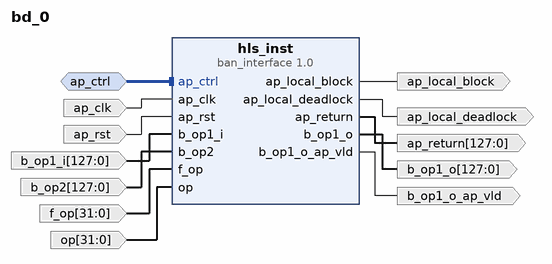
[diagram p0: block diagram of the top level]
# Vivado block design bd_0, xczu7ev-ffvc1156-2-e, Vivado 2021.2
create_bd_design bd_0

create_bd_intf_port -mode Slave -vlnv xilinx.com:interface:acc_handshake_rtl:1.0 ap_ctrl
create_bd_port -dir I -type clk ap_clk
set_property -dict {CONFIG.FREQ_HZ 100000000.0} [get_bd_ports ap_clk]
create_bd_port -dir O ap_local_block
create_bd_port -dir O ap_local_deadlock
create_bd_port -dir O -from 127 -to 0 -type data ap_return
create_bd_port -dir I -type rst ap_rst
set_property -dict {CONFIG.POLARITY ACTIVE_HIGH} [get_bd_ports ap_rst]
create_bd_port -dir I -from 127 -to 0 -type data b_op1_i
create_bd_port -dir O -from 127 -to 0 -type data b_op1_o
create_bd_port -dir O b_op1_o_ap_vld
create_bd_port -dir I -from 127 -to 0 -type data b_op2
create_bd_port -dir I -from 31 -to 0 -type data f_op
create_bd_port -dir I -from 31 -to 0 -type data op

create_bd_cell -type ip -vlnv xilinx.com:hls:ban_interface:1.0 hls_inst

# ---- connections ----

connect_bd_intf_net -intf_net ap_ctrl_0_1 [get_bd_intf_ports ap_ctrl] [get_bd_intf_pins hls_inst/ap_ctrl]
connect_bd_net -net ap_clk_0_1 [get_bd_ports ap_clk] [get_bd_pins hls_inst/ap_clk]
connect_bd_net -net ap_rst_0_1 [get_bd_ports ap_rst] [get_bd_pins hls_inst/ap_rst]
connect_bd_net -net b_op1_i_0_1 [get_bd_ports b_op1_i] [get_bd_pins hls_inst/b_op1_i]
connect_bd_net -net b_op2_0_1 [get_bd_ports b_op2] [get_bd_pins hls_inst/b_op2]
connect_bd_net -net f_op_0_1 [get_bd_ports f_op] [get_bd_pins hls_inst/f_op]
connect_bd_net [get_bd_pins hls_inst/ap_local_block] [get_bd_ports ap_local_block]
connect_bd_net [get_bd_pins hls_inst/ap_local_deadlock] [get_bd_ports ap_local_deadlock]
connect_bd_net [get_bd_pins hls_inst/ap_return] [get_bd_ports ap_return]
connect_bd_net [get_bd_pins hls_inst/b_op1_o] [get_bd_ports b_op1_o]
connect_bd_net [get_bd_pins hls_inst/b_op1_o_ap_vld] [get_bd_ports b_op1_o_ap_vld]
connect_bd_net -net op_0_1 [get_bd_ports op] [get_bd_pins hls_inst/op]

validate_bd_design
save_bd_design
